# Altium schematic sheet Sheet1.SCHDOC
size 508 x 508 mm; SheetNumber: 1; SheetTotal: 1; DocumentName: Sheet1.SCHDOC
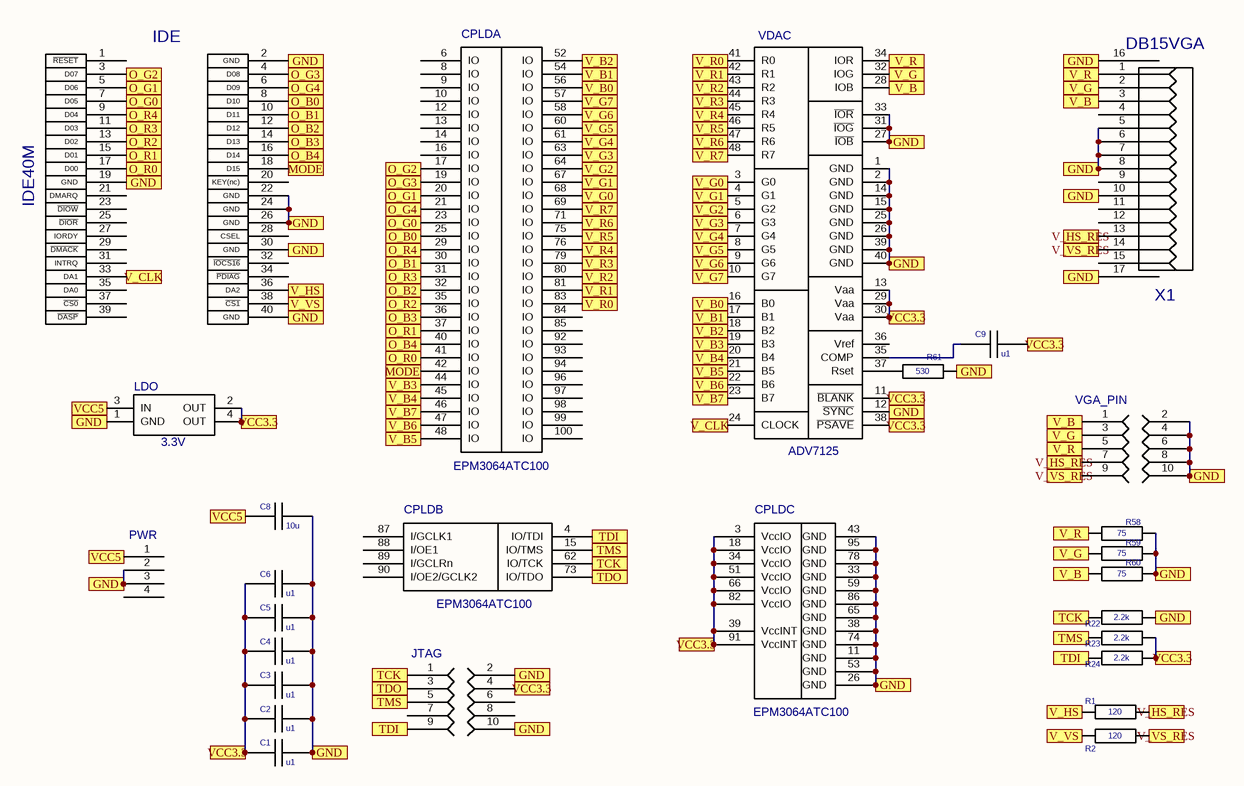
[diagram p0: Sheet1.SCHDOC]

## Parts
C1  value u1  [SMD-1608-0603]  (hidden comment: CAP-1608-0603)
C2  value u1  [SMD-1608-0603]  (hidden comment: CAP-1608-0603)
C3  value u1  [SMD-1608-0603]  (hidden comment: CAP-1608-0603)
C4  value u1  [SMD-1608-0603]  (hidden comment: CAP-1608-0603)
C5  value u1  [SMD-1608-0603]  (hidden comment: CAP-1608-0603)
C6  value u1  [SMD-1608-0603]  (hidden comment: CAP-1608-0603)
C8  value 10u  [SMD-3216-1206]  (hidden comment: CAP-3216-1206)
C9  value u1  [SMD-1608-0603]  (hidden comment: CAP-1608-0603)
CPLD  EPM3064ATC100  [QFP14X14-100]  (parts A,B,C of 3)
IDE  IDE40M  [IDE40M]
JTAG  DIP-HDR-2X5  [DIP-HEAD-2X5]  (value not drawn)
LDO  value 3.3V  [ZZ311]  (hidden comment: VREG1117)
PWR  DIP-HDR-4  [DIP-HEAD-4]  (value not drawn)
R1  value 120  [SMD-1608-0603]  (hidden comment: RES-1608-0603)
R2  value 120  [SMD-1608-0603]  (hidden comment: RES-1608-0603)
R22  value 2.2k  [SMD-1608-0603]  (hidden comment: RES-1608-0603)
R23  value 2.2k  [SMD-1608-0603]  (hidden comment: RES-1608-0603)
R24  value 2.2k  [SMD-1608-0603]  (hidden comment: RES-1608-0603)
R58  value 75  [SMD-1608-0603]  (hidden comment: RES-1608-0603)
R59  value 75  [SMD-1608-0603]  (hidden comment: RES-1608-0603)
R60  value 75  [SMD-1608-0603]  (hidden comment: RES-1608-0603)
R61  value 530  [SMD-1608-0603]  (hidden comment: RES-1608-0603)
VDAC  ADV7125  [LQFP7X7-48]
VGA_PIN  DIP-HDR-2X5  [DIP-HEAD-2X5]  (value not drawn)
X1  DB15VGA  [DB15VGA]

## Ports
GND, MODE (out), O_B0 (out), O_B1 (out), O_B2 (out), O_B3 (out), O_B4 (out), O_G0 (out), O_G1 (out), O_G2 (out), O_G3 (out), O_G4 (out), O_R0 (out), O_R1 (out), O_R2 (out), O_R3 (out), O_R4 (out), TCK (in), TCK (out), TDI (in), TDI (out), TDO (in), TDO (out), TMS (in), TMS (out), V_B0 (in), V_B0 (out), V_B1 (in), V_B1 (out), V_B2 (in), V_B2 (out), V_B3 (in), V_B3 (out), V_B4 (in), V_B4 (out), V_B5 (in), V_B5 (out), V_B6 (in), V_B6 (out), V_B7 (in), V_B7 (out), V_B (in), V_B (out), V_CLK (in), V_CLK (out), V_G0 (in), V_G0 (out), V_G1 (in), V_G1 (out), V_G2 (in), V_G2 (out), V_G3 (in), V_G3 (out), V_G4 (in), V_G4 (out), V_G5 (in), V_G5 (out), V_G6 (in), V_G6 (out), V_G7 (in), V_G7 (out), V_G (in), V_G (out), V_HS (in), V_HS (out), V_HS_RES (in), V_HS_RES (out), V_R0 (in), V_R0 (out), V_R1 (in), V_R1 (out), V_R2 (in), V_R2 (out), V_R3 (in), V_R3 (out), V_R4 (in), V_R4 (out), V_R5 (in), V_R5 (out), V_R6 (in), V_R6 (out), V_R7 (in), V_R7 (out), V_R (in), V_R (out), V_VS (in), V_VS (out), V_VS_RES (in), V_VS_RES (out), VCC3.3, VCC5

## Nets
GND: C1.2 C2.2 C3.2 C4.2 C5.2 C6.2 C8.2 CPLD.11(GND) CPLD.26(GND) CPLD.33(GND) CPLD.38(GND) CPLD.43(GND) CPLD.53(GND) CPLD.59(GND) CPLD.65(GND) CPLD.74(GND) CPLD.78(GND) CPLD.86(GND) CPLD.95(GND) IDE.2(GND) IDE.19(GND) IDE.22(GND) IDE.24(GND) IDE.26(GND) IDE.30(GND) IDE.40(GND) JTAG.2 JTAG.10 LDO.1(GND) PWR.2 PWR.3 R22.1(i/o) R58.2(i/o1) R59.2(i/o1) R60.2(i/o1) R61.1(i/o) VDAC.1(GND) VDAC.2(GND) VDAC.12(~{SYNC}) VDAC.14(GND) VDAC.15(GND) VDAC.25(GND) VDAC.26(GND) VDAC.27(~{IOB}) VDAC.31(~{IOG}) VDAC.33(~{IOR}) VDAC.39(GND) VDAC.40(GND) VGA_PIN.2 VGA_PIN.4 VGA_PIN.6 VGA_PIN.8 VGA_PIN.10 X1.5 X1.6 X1.7 X1.8 X1.10 X1.16 X1.17 ; port GND
MODE: CPLD.42(IO) IDE.18(D15) ; port MODE
O_B0: CPLD.25(IO) IDE.8(D10) ; port O_B0
O_B1: CPLD.30(IO) IDE.10(D11) ; port O_B1
O_B2: CPLD.32(IO) IDE.12(D12) ; port O_B2
O_B3: CPLD.36(IO) IDE.14(D13) ; port O_B3
O_B4: CPLD.40(IO) IDE.16(D14) ; port O_B4
O_G0: CPLD.23(IO) IDE.7(D05) ; port O_G0
O_G1: CPLD.20(IO) IDE.5(D06) ; port O_G1
O_G2: CPLD.17(IO) IDE.3(D07) ; port O_G2
O_G3: CPLD.19(IO) IDE.4(D08) ; port O_G3
O_G4: CPLD.21(IO) IDE.6(D09) ; port O_G4
O_R0: CPLD.41(IO) IDE.17(D00) ; port O_R0
O_R1: CPLD.37(IO) IDE.15(D01) ; port O_R1
O_R2: CPLD.35(IO) IDE.13(D02) ; port O_R2
O_R3: CPLD.31(IO) IDE.11(D03) ; port O_R3
O_R4: CPLD.29(IO) IDE.9(D04) ; port O_R4
TCK: CPLD.62(IO/TCK) JTAG.1 R22.2(i/o1) ; port TCK
TDI: CPLD.4(IO/TDI) JTAG.9 R24.2(i/o1) ; port TDI
TDO: CPLD.73(IO/TDO) JTAG.3 ; port TDO
TMS: CPLD.15(IO/TMS) JTAG.5 R23.2(i/o1) ; port TMS
V_B: R60.1(i/o) VDAC.28(IOB) VGA_PIN.1 X1.3 ; port V_B
V_B0: CPLD.56(IO) VDAC.16(B0) ; port V_B0
V_B1: CPLD.54(IO) VDAC.17(B1) ; port V_B1
V_B2: CPLD.52(IO) VDAC.18(B2) ; port V_B2
V_B3: CPLD.44(IO) VDAC.19(B3) ; port V_B3
V_B4: CPLD.45(IO) VDAC.20(B4) ; port V_B4
V_B5: CPLD.48(IO) VDAC.21(B5) ; port V_B5
V_B6: CPLD.47(IO) VDAC.22(B6) ; port V_B6
V_B7: CPLD.46(IO) VDAC.23(B7) ; port V_B7
V_CLK: IDE.33(DA1) VDAC.24(CLOCK) ; port V_CLK
V_G: R59.1(i/o) VDAC.32(IOG) VGA_PIN.3 X1.2 ; port V_G
V_G0: CPLD.68(IO) VDAC.3(G0) ; port V_G0
V_G1: CPLD.67(IO) VDAC.4(G1) ; port V_G1
V_G2: CPLD.64(IO) VDAC.5(G2) ; port V_G2
V_G3: CPLD.63(IO) VDAC.6(G3) ; port V_G3
V_G4: CPLD.61(IO) VDAC.7(G4) ; port V_G4
V_G5: CPLD.60(IO) VDAC.8(G5) ; port V_G5
V_G6: CPLD.58(IO) VDAC.9(G6) ; port V_G6
V_G7: CPLD.57(IO) VDAC.10(G7) ; port V_G7
V_HS: IDE.36(DA2) R1.1(i/o) ; port V_HS
V_HS_RES: R1.2(i/o1) VGA_PIN.7 X1.13 ; port V_HS_RES
V_R: R58.1(i/o) VDAC.34(IOR) VGA_PIN.5 X1.1 ; port V_R
V_R0: CPLD.83(IO) VDAC.41(R0) ; port V_R0
V_R1: CPLD.81(IO) VDAC.42(R1) ; port V_R1
V_R2: CPLD.80(IO) VDAC.43(R2) ; port V_R2
V_R3: CPLD.79(IO) VDAC.44(R3) ; port V_R3
V_R4: CPLD.76(IO) VDAC.45(R4) ; port V_R4
V_R5: CPLD.75(IO) VDAC.46(R5) ; port V_R5
V_R6: CPLD.71(IO) VDAC.47(R6) ; port V_R6
V_R7: CPLD.69(IO) VDAC.48(R7) ; port V_R7
V_VS: IDE.38(~{CS1}) R2.1(i/o) ; port V_VS
V_VS_RES: R2.2(i/o1) VGA_PIN.9 X1.14 ; port V_VS_RES
VCC3.3: C1.1 C2.1 C3.1 C4.1 C5.1 C6.1 C9.2 CPLD.3(VccIO) CPLD.18(VccIO) CPLD.34(VccIO) CPLD.39(VccINT) CPLD.51(VccIO) CPLD.66(VccIO) CPLD.82(VccIO) CPLD.91(VccINT) JTAG.4 LDO.2(OUT) LDO.4(OUT) R23.1(i/o) R24.1(i/o) VDAC.11(~{BLANK}) VDAC.13(Vaa) VDAC.29(Vaa) VDAC.30(Vaa) VDAC.38(~{PSAVE}) ; port VCC3.3
VCC5: C8.1 LDO.3(IN) PWR.1 ; port VCC5
NetC9_1: C9.1 VDAC.35(COMP)
NetR61_2: R61.2(i/o1) VDAC.37(Rset)

Not connected (* = marked no-connect by the designer): CPLD 6(IO) 8(IO) 9(IO) 10(IO) 12(IO) 13(IO) 14(IO) 16(IO) 84(IO) 85(IO) 87(I/GCLK1) 88(I/OE1) 89(I/GCLRn) 90(I/OE2/GCLK2) 92(IO) 93(IO) 94(IO) 96(IO) 97(IO) 98(IO) 99(IO) 100(IO); IDE 1(~{RESET}) 20(KEY(nc)) 21(DMARQ) 23(~{DIOW}) 25(~{DIOR}) 27(IORDY) 28(CSEL) 29(~{DMACK}) 31(INTRQ) 32(~{IOCS16}) 34(~{PDIAG}) 35(DA0) 37(~{CS0}) 39(~{DASP}); JTAG 6 7 8; PWR 4; VDAC 36(Vref); X1 4 9 11 12 15

## Library data of the parts
CPLD = EPM3064ATC100: Value: *
IDE = IDE40M: Value: *
PWR = DIP-HDR-4: Value: *
VDAC = ADV7125: Value: *
X1 = DB15VGA: Value: *